# EAGLE design TouchSwitch-V2.0 (EAGLE 9.6.2)
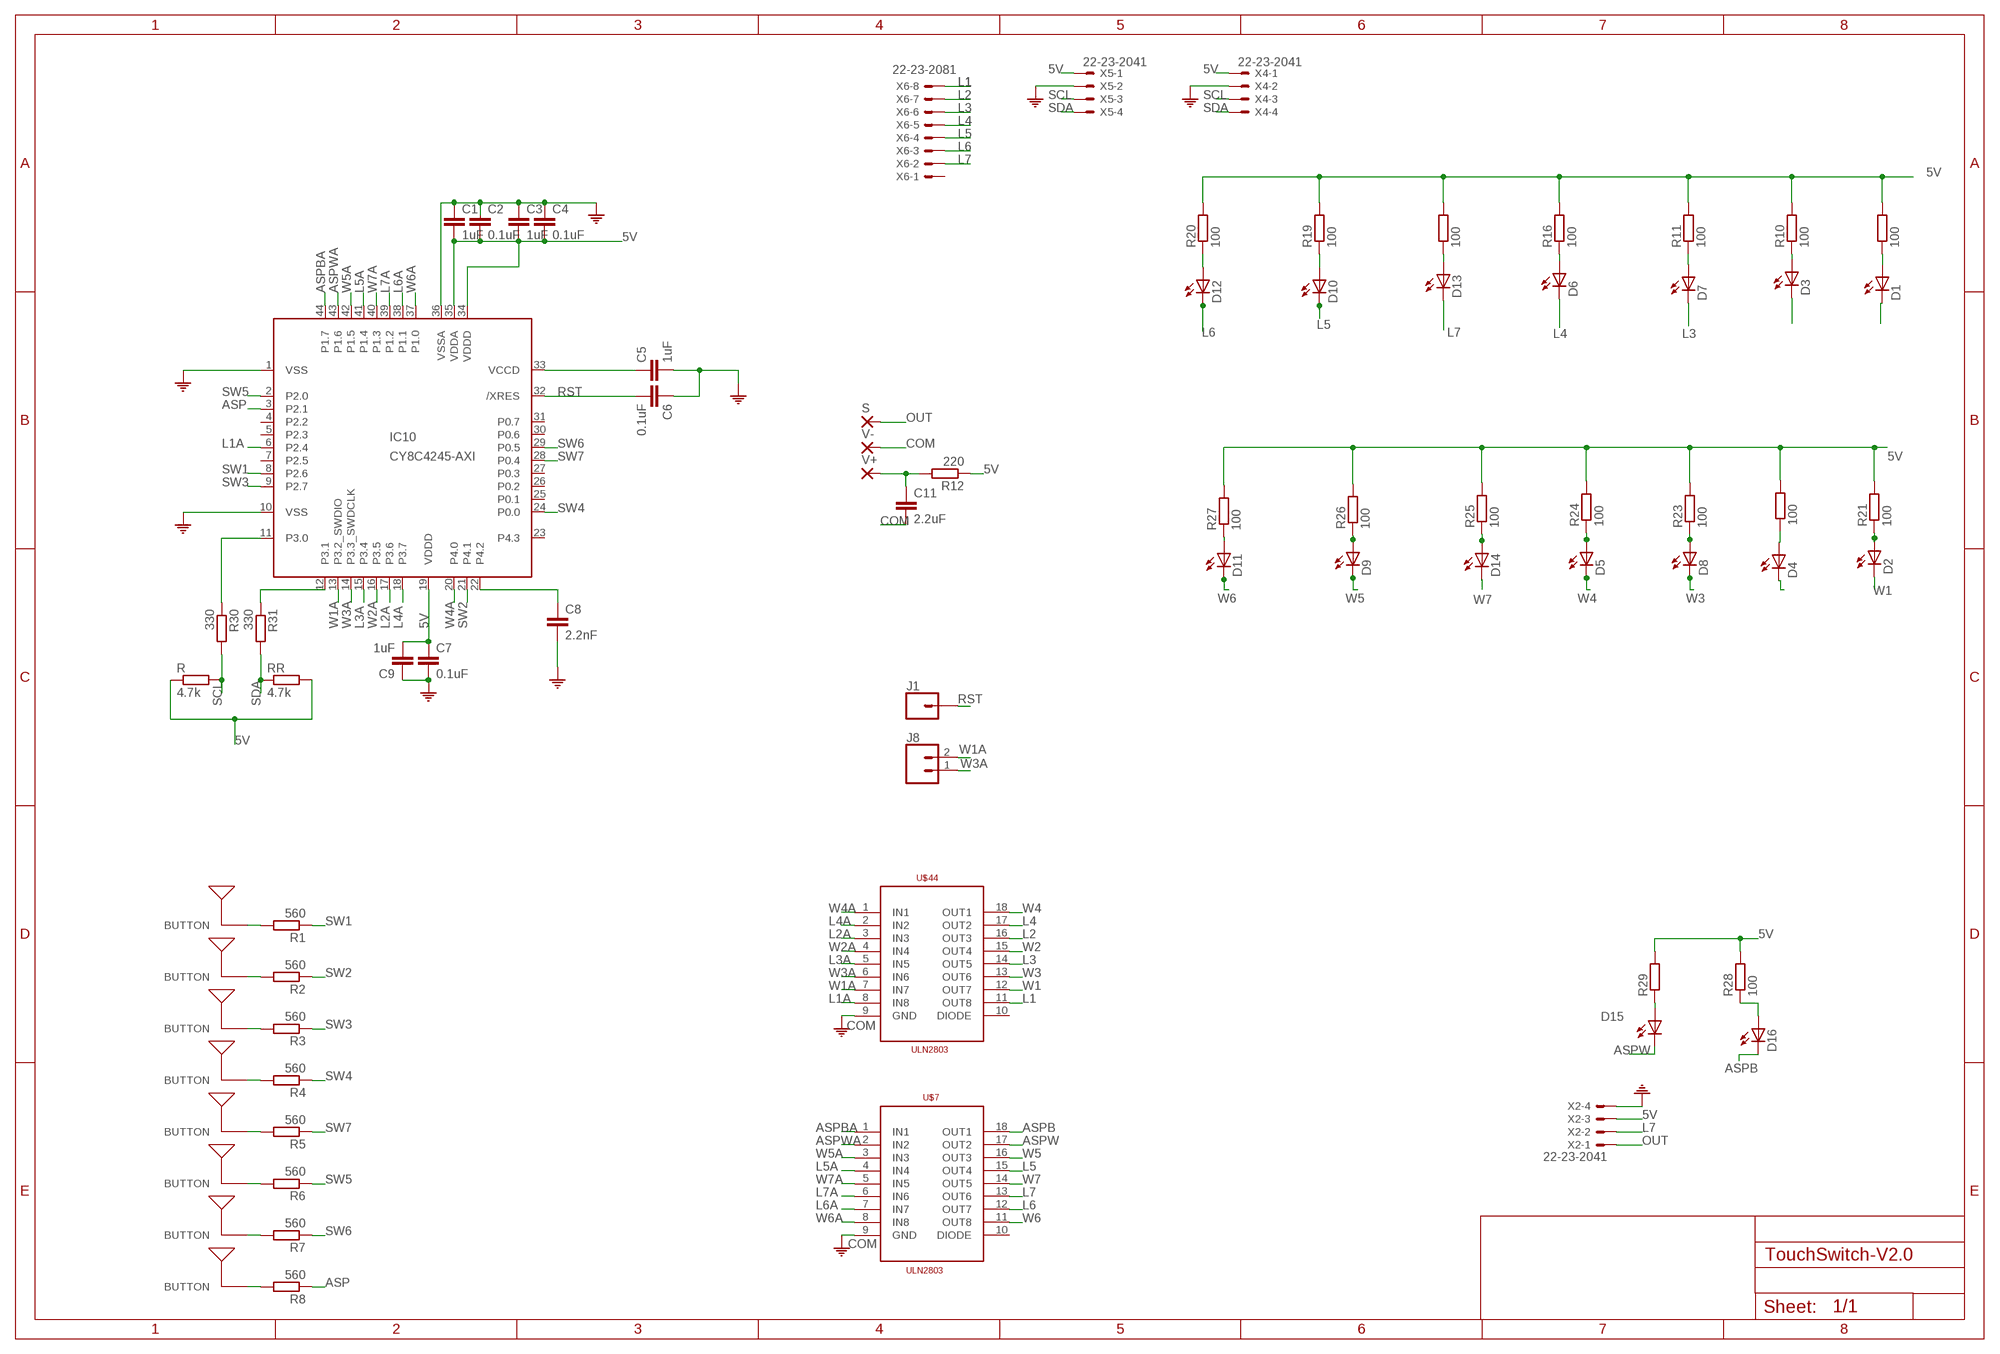
[diagram p0: schematic, sheet 1]

## Parts
B1  BUTTON_PASSIVE12MM  [BUTTON_PASSIVE_12MM]
B2  BUTTON_PASSIVE12MM  [BUTTON_PASSIVE_12MM]
B3  BUTTON_PASSIVE12MM  [BUTTON_PASSIVE_12MM]
B4  BUTTON_PASSIVE12MM  [BUTTON_PASSIVE_12MM]
B5  BUTTON_PASSIVE12MM  [BUTTON_PASSIVE_12MM]
B6  BUTTON_PASSIVE12MM  [BUTTON_PASSIVE_12MM]
B7  BUTTON_PASSIVE12MM  [BUTTON_PASSIVE_12MM]
B8  BUTTON_PASSIVE12MM  [BUTTON_PASSIVE_12MM]
C1  1uF  C-EUC1206  [C1206]
C2  0.1uF  C-EUC1206  [C1206]
C3  1uF  C-EUC1206  [C1206]
C4  0.1uF  C-EUC1206  [C1206]
C5  1uF  C-EUC1206  [C1206]
C6  0.1uF  C-EUC1206  [C1206]
C7  0.1uF  C-EUC1206  [C1206]
C8  2.2nF  C-EUC1206  [C1206]
C9  1uF  C-EUC1206  [C1206]
C11  2.2uF  C-EUC1206  [C1206]
D1  LEDCHIPLED_1206  [CHIPLED_1206]
D2  LEDCHIPLED_1206  [CHIPLED_1206]
D3  LEDCHIPLED_1206  [CHIPLED_1206]
D4  LEDCHIPLED_1206  [CHIPLED_1206]
D5  LEDCHIPLED_1206  [CHIPLED_1206]
D6  LEDCHIPLED_1206  [CHIPLED_1206]
D7  LEDCHIPLED_1206  [CHIPLED_1206]
D8  LEDCHIPLED_1206  [CHIPLED_1206]
D9  LEDCHIPLED_1206  [CHIPLED_1206]
D10  LEDCHIPLED_1206  [CHIPLED_1206]
D11  LEDCHIPLED_1206  [CHIPLED_1206]
D12  LEDCHIPLED_1206  [CHIPLED_1206]
D13  LEDCHIPLED_1206  [CHIPLED_1206]
D14  LEDCHIPLED_1206  [CHIPLED_1206]
D15  LEDCHIPLED_1206  [CHIPLED_1206]
D16  LEDCHIPLED_1206  [CHIPLED_1206]
IC10  CY8C4245-AXI  [44-TQFP-0.8]
J1  CONN_01  [1X01]
J8  CONN_02  [1X02]
R  4.7k  R-EU_R0805  [R0805]
R1  560  R-EU_R0805  [R0805]
R2  560  R-EU_R0805  [R0805]
R3  560  R-EU_R0805  [R0805]
R4  560  R-EU_R0805  [R0805]
R5  560  R-EU_R0805  [R0805]
R6  560  R-EU_R0805  [R0805]
R7  560  R-EU_R0805  [R0805]
R8  560  R-EU_R0805  [R0805]
R9  100  R-EU_R0805  [R0805]
R10  100  R-EU_R0805  [R0805]
R11  100  R-EU_R0805  [R0805]
R12  220  R-EU_R0805  [R0805]
R16  100  R-EU_R0805  [R0805]
R18  100  R-EU_R0805  [R0805]
R19  100  R-EU_R0805  [R0805]
R20  100  R-EU_R0805  [R0805]
R21  100  R-EU_R0805  [R0805]
R22  100  R-EU_R0805  [R0805]
R23  100  R-EU_R0805  [R0805]
R24  100  R-EU_R0805  [R0805]
R25  100  R-EU_R0805  [R0805]
R26  100  R-EU_R0805  [R0805]
R27  100  R-EU_R0805  [R0805]
R28  100  R-EU_R0805  [R0805]
R29  100  R-EU_R0805  [R0805]
R30  330  R-EU_R0805  [R0805]
R31  330  R-EU_R0805  [R0805]
RR  4.7k  R-EU_R0805  [R0805]
S  SMD2  [SMD1,27-2,54]
U$7  ULN2803  [SO18L]
U$44  ULN2803  [SO18L]
V+  SMD2  [SMD1,27-2,54]
V-  SMD2  [SMD1,27-2,54]
X2  22-23-2041  [22-23-2041]
X4  22-23-2041  [22-23-2041]
X5  22-23-2041  [22-23-2041]
X6  22-23-2081  [22-23-2081]

## Nets
5V: C1.2 C2.2 C3.2 C4.2 C7.1 C9.2 IC10.19(VDDD) IC10.34(VDDD) IC10.35(VDDA) R9.2 R10.2 R11.2 R12.1 R16.2 R18.2 R19.2 R20.2 R21.2 R22.2 R23.2 R24.2 R25.2 R26.2 R27.2 R28.2 R29.2 R.1 RR.2 X2.3 X4.1 X5.1
ASP: IC10.3(P2.1) R8.1
ASPB: D16.C U$7.18(OUT1)
ASPBA: IC10.44(P1.7) U$7.1(IN1)
ASPW: D15.C U$7.17(OUT2)
ASPWA: IC10.43(P1.6) U$7.2(IN2)
COM: C1.1 C2.1 C3.1 C4.1 C5.2 C6.1 C7.2 C8.2 C9.1 C11.2 IC10.1(VSS) IC10.10(VSS) IC10.36(VSSA) U$7.9(GND) U$44.9(GND) V-.1(P) X2.4 X4.2 X5.2
L1: D1.C U$44.11(OUT8) X6.8
L1A: IC10.6(P2.4) U$44.8(IN8)
L2: D3.C U$44.16(OUT3) X6.7
L2A: IC10.17(P3.6) U$44.3(IN3)
L3: D7.C U$44.14(OUT5) X6.6
L3A: IC10.15(P3.4) U$44.5(IN5)
L4: D6.C U$44.17(OUT2) X6.5
L4A: IC10.18(P3.7) U$44.2(IN2)
L5: D10.C U$7.15(OUT4) X6.4
L5A: IC10.41(P1.4) U$7.4(IN4)
L6: D12.C U$7.12(OUT7) X6.3
L6A: IC10.38(P1.1) U$7.7(IN7)
L7: D13.C U$7.13(OUT6) X2.2 X6.2
L7A: IC10.39(P1.2) U$7.6(IN6)
N$1: C8.1 IC10.22(P4.2)
N$2: B8.P$1(BUTTON) R1.2
N$3: IC10.11(P3.0) R30.1
N$4: B1.P$1(BUTTON) R2.2
N$5: IC10.12(P3.1) R31.1
N$6: D10.A R19.1
N$7: B2.P$1(BUTTON) R3.2
N$8: B3.P$1(BUTTON) R4.2
N$9: B4.P$1(BUTTON) R5.2
N$10: B5.P$1(BUTTON) R6.2
N$11: B6.P$1(BUTTON) R7.2
N$12: D13.A R18.1
N$13: C11.1 R12.2 V+.1(P)
N$14: D12.A R20.1
N$15: D6.A R16.1
N$16: B7.P$1(BUTTON) R8.2
N$17: D7.A R11.1
N$19: D15.A R29.1
N$23: D3.A R10.1
N$24: D1.A R9.1
N$25: D5.A R24.1
N$26: D11.A R27.1
N$27: D9.A R26.1
N$28: D14.A R25.1
N$29: D2.A R21.1
N$30: D4.A R22.1
N$31: D8.A R23.1
N$32: D16.A R28.1
N$47: C5.1 IC10.33(VCCD)
OUT: S.1(P) X2.1
RST: C6.2 IC10.32(/XRES) J1.1
SCL: R30.2 R.2 X4.3 X5.3
SDA: R31.2 RR.1 X4.4 X5.4
SW1: IC10.8(P2.6) R1.1
SW2: IC10.21(P4.1) R2.1
SW3: IC10.9(P2.7) R3.1
SW4: IC10.24(P0.0) R4.1
SW5: IC10.2(P2.0) R6.1
SW6: IC10.29(P0.5) R7.1
SW7: IC10.28(P0.4) R5.1
W1: D2.C U$44.12(OUT7)
W1A: IC10.13(P3.2_SWDIO) J8.2 U$44.7(IN7)
W2: D4.C U$44.15(OUT4)
W2A: IC10.16(P3.5) U$44.4(IN4)
W3: D8.C U$44.13(OUT6)
W3A: IC10.14(P3.3_SWDCLK) J8.1 U$44.6(IN6)
W4: D5.C U$44.18(OUT1)
W4A: IC10.20(P4.0) U$44.1(IN1)
W5: D9.C U$7.16(OUT3)
W5A: IC10.42(P1.5) U$7.3(IN3)
W6: D11.C U$7.11(OUT8)
W6A: IC10.37(P1.0) U$7.8(IN8)
W7: D14.C U$7.14(OUT5)
W7A: IC10.40(P1.3) U$7.5(IN5)
Unconnected: IC10.4(P2.2) IC10.5(P2.3) IC10.7(P2.5) IC10.23(P4.3) IC10.25(P0.1) IC10.26(P0.2) IC10.27(P0.3) IC10.30(P0.6) IC10.31(P0.7) U$7.10(DIODE) U$44.10(DIODE) X6.1

## Library data of the parts
B1-B8 = Touch mask demo - Copy:BUTTON_PASSIVE: Button, Passive Capacitive/Touch Sensing Type Source : http://www.PatternAgents.com Github : https://github.com/PatternAgents License : http://creativecommons.org/licenses/by-sa/3.1/ (Creative Commons 3.1) THIS SOFTWARE IS PROVIDED BY THE CONTRIBUTORS "AS IS" AND WITHOUT ANY EXPRESS OR IMPLIED WARRANTIES, INCLUDING, BUT NOT LIMITED TO, THE IMPLIED WARRANTIES OF MERCHANTABILITY AND FITNESS FOR A PARTICULAR PURPOSE ARE DISCLAIMED. IN NO EVENT SHALL THE COPYRIGHT OWNER OR CONTRIBUTORS BE LIABLE FOR ANY DIRECT, INDIRECT, INCIDENTAL, SPECIAL, EXEMPLARY, OR CONSEQUENTIAL DAMAGES (INCLUDING, BUT NOT LIMITED TO, PROCUREMENT OF SUBSTITUTE GOODS OR SERVICES; LOSS OF USE, DATA, OR PROFITS; OR BUSINESS INTERRUPTION) HOWEVER CAUSED AND ON ANY THEORY OF LIABILITY, WHETHER IN CONTRACT, STRICT LIABILITY, OR TORT (INCLUDING NEGLIGENCE OR OTHERWISE) ARISING IN ANY WAY OUT OF THE USE OF THIS SOFTWARE, EVEN IF ADVISED OF THE POSSIBILITY OF SUCH DAMAGE.
C1-C9 C11 = rcl:C-EU: CAPACITOR, European symbol; SPICEPREFIX: C
D1-D16 = led:LED: LED OSRAM: - CHIPLED LG R971, LG N971, LY N971, LG Q971, LY Q971, LO R971, LY R971 LH N974, LH R974 LS Q976, LO Q976, LY Q976 LO Q996 - Hyper CHIPLED LW Q18S LB Q993, LB Q99A, LB R99A - SideLED LS A670, LO A670, LY A670, LG A670, LP A670 LB A673, LV A673, LT A673, LW A673 LH A674 LY A675 LS A676, LA A676, LO A676, LY A676, LW A676 LS A679, LY A679, LG A679 - Hyper Micro SIDELED® LS Y876, LA Y876, LO Y876, LY Y876 LT Y87S - SmartLED LW L88C, LW L88S LB L89C, LB L89S, LG L890 LS L89K, LO L89K, LY L89K LS L896, LA L896, LO L896, LY L896 - TOPLED LS T670, LO T670, LY T670, LG T670, LP T670 LSG T670, LSP T670, LSY T670, LOP T670, LYG T670 LG T671, LOG T671, LSG T671 LB T673, LV T673, LT T673, LW T673 LH T674 LS T676, LA T676, LO T676, LY T676, LB T676, LH T676, LSB T676, LW T676 LB T67C, LV T67C, LT T67C, LS T67K, LO T67K, LY T67K, LW E67C LS E67B, LA E67B, LO E67B, LY E67B, LB E67C, LV E67C, LT E67C LW T67C LS T679, LY T679, LG T679 LS T770, LO T770, LY T770, LG T770, LP T770 LB T773, LV T773, LT T773, LW T773 LH T774 LS E675, LA E675, LY E675, LS T675 LS T776, LA T776, LO T776, LY T776, LB T776 LHGB T686 LT T68C, LB T68C - Hyper Mini TOPLED® LB M676 - Mini TOPLED Santana® LG M470 LS M47K, LO M47K, LY M47K Source: http://www.osram.convergy.de LUXEON: - LUMILED® LXK2-PW12-R00, LXK2-PW12-S00, LXK2-PW14-U00, LXK2-PW14-V00 LXK2-PM12-R00, LXK2-PM12-S00, LXK2-PM14-U00 LXK2-PE12-Q00, LXK2-PE12-R00, LXK2-PE12-S00, LXK2-PE14-T00, LXK2-PE14-U00 LXK2-PB12-K00, LXK2-PB12-L00, LXK2-PB12-M00, LXK2-PB14-N00, LXK2-PB14-P00, LXK2-PB14-Q00 LXK2-PR12-L00, LXK2-PR12-M00, LXK2-PR14-Q00, LXK2-PR14-R00 LXK2-PD12-Q00, LXK2-PD12-R00, LXK2-PD12-S00 LXK2-PH12-R00, LXK2-PH12-S00 LXK2-PL12-P00, LXK2-PL12-Q00, LXK2-PL12-R00 Source: www.luxeon.com KINGBRIGHT: KA-3528ASYC Source: www.kingbright.com
IC10 = CY8C4200:CY8C4245: PSOC4200 in TQFP-44 Source:
J1 = SparkFun-Connectors:CONN_01: Single connection point. Often used as Generic Header-pin footprint for 0.1 inch spaced/style header connections On any of the 0.1 inch spaced packages, you can populate with these: Break Away Headers - Straight <https://www.sparkfun.com/products/116> (PRT-00116) Break Away Male Headers - Right Angle <https://www.sparkfun.com/products/553> (PRT-00553) Female Headers <https://www.sparkfun.com/products/115> (PRT-00115) Break Away Headers - Machine Pin <https://www.sparkfun.com/products/117> (PRT-00117) Break Away Female Headers - Swiss Machine Pin <https://www.sparkfun.com/products/743> (PRT-00743) This device is also useful as a general connection point to wire up your design to another part of your project. Our various solder wires solder well into these plated through hole pads. Hook-Up Wire - Assortment (Stranded, 22 AWG) <https://www.sparkfun.com/products/11375> (PRT-11375) Hook-Up Wire - Assortment (Solid Core, 22 AWG) <https://www.sparkfun.com/products/11367> (PRT-11367) View the entire wire category on our website here <https://www.sparkfun.com/categories/141> Special notes: SMTSO-256-ET is a "flush mount" nut for a 4-40 screw. We mostly use this on specialty testbeds; it is a nice way to connect hardware to your PCB at an adjustable hieght. Also note, the SNAP packages are for using a snappable style connector. We sell a baggie of snaps and they are also used on two LilyPad designs: Snap Assortment - 30 pack (male and female) <https://www.sparkfun.com/products/11347> (DEV-11347) LilyPad Arduino SimpleSnap <https://www.sparkfun.com/products/10941> (DEV-10941) LilyPad SimpleSnap Protoboard <https://www.sparkfun.com/products/10940> (DEV-10940)
J8 = SparkFun-Connectors:CONN_02: Multi connection point. Often used as Generic Header-pin footprint for 0.1 inch spaced/style header connections On any of the 0.1 inch spaced packages, you can populate with these: Break Away Headers - Straight <https://www.sparkfun.com/products/116> (PRT-00116) Break Away Male Headers - Right Angle <https://www.sparkfun.com/products/553> (PRT-00553) Female Headers <https://www.sparkfun.com/products/115> (PRT-00115) Break Away Headers - Machine Pin <https://www.sparkfun.com/products/117> (PRT-00117) Break Away Female Headers - Swiss Machine Pin <https://www.sparkfun.com/products/743> (PRT-00743) For SCREWTERMINALS and SPRING TERMINALS visit here: Screw Terimnals on SparkFun.com <https://www.sparkfun.com/search/results?term=Screw+Terminals> (5mm/3.5mm/2.54mm spacing) This device is also useful as a general connection point to wire up your design to another part of your project. Our various solder wires solder well into these plated through hole pads. Hook-Up Wire - Assortment (Stranded, 22 AWG) <https://www.sparkfun.com/products/11375> (PRT-11375) Hook-Up Wire - Assortment (Solid Core, 22 AWG) <https://www.sparkfun.com/products/11367> (PRT-11367) View the entire wire category on our website here <https://www.sparkfun.com/categories/141> Special notes: Molex polarized connector foot print use with: PRT-08233 with associated crimp pins and housings. 2.54_SCREWTERM for use with PRT-10571. 3.5mm Screw Terminal footprints for PRT-08084 5mm Screw Terminal footprints for use with PRT-08432
R R1-R12 R16 R18-R31 RR = resistor:R-EU_: RESISTOR, European symbol
S V+ V- = wirepad:SMD2: SMD PAD
U$7 U$44 = uln2803:ULN2803
X2 X4 X5 = con-molex-new white color :22-23-2041: .100" (2.54mm) Center Header - 4 Pin
X6 = con-molex-new white color :22-23-2081: .100" (2.54mm) Center Header - 8 Pin

## Board
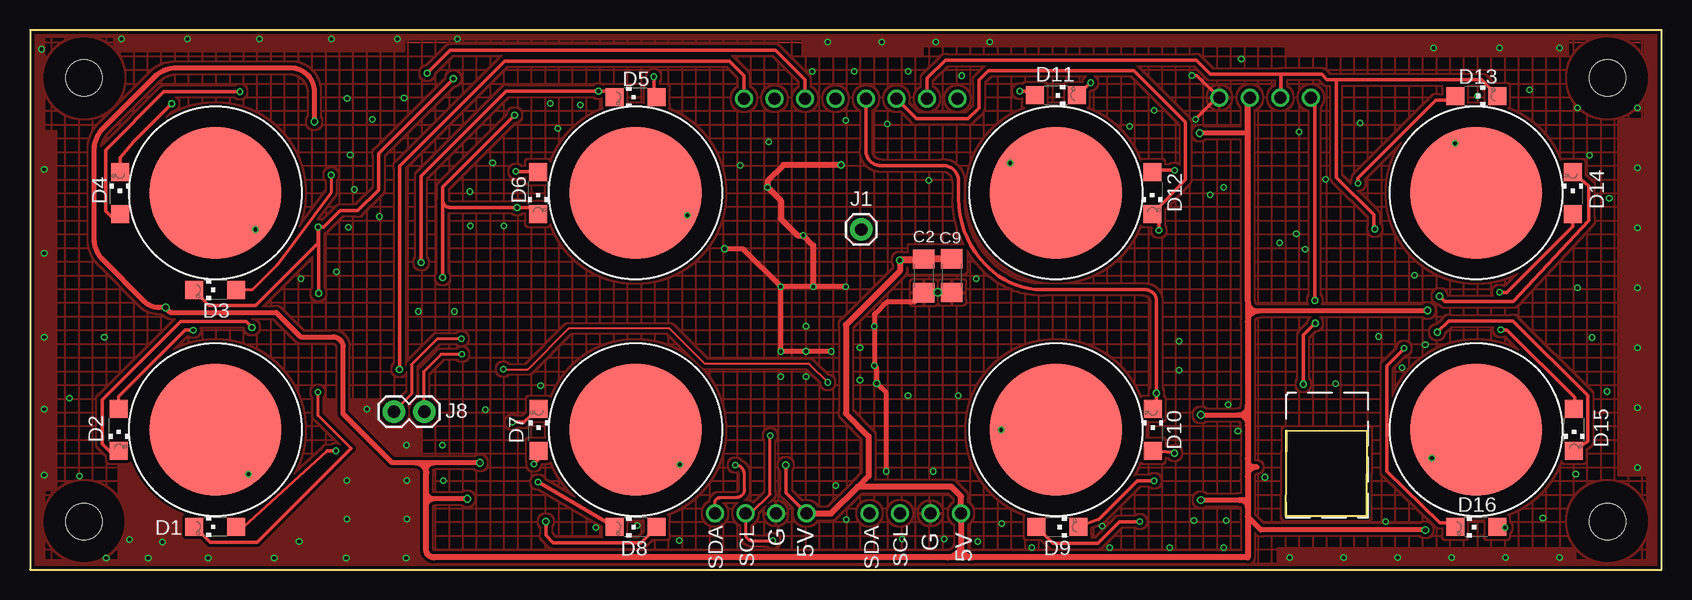
[diagram p1: board, top side]
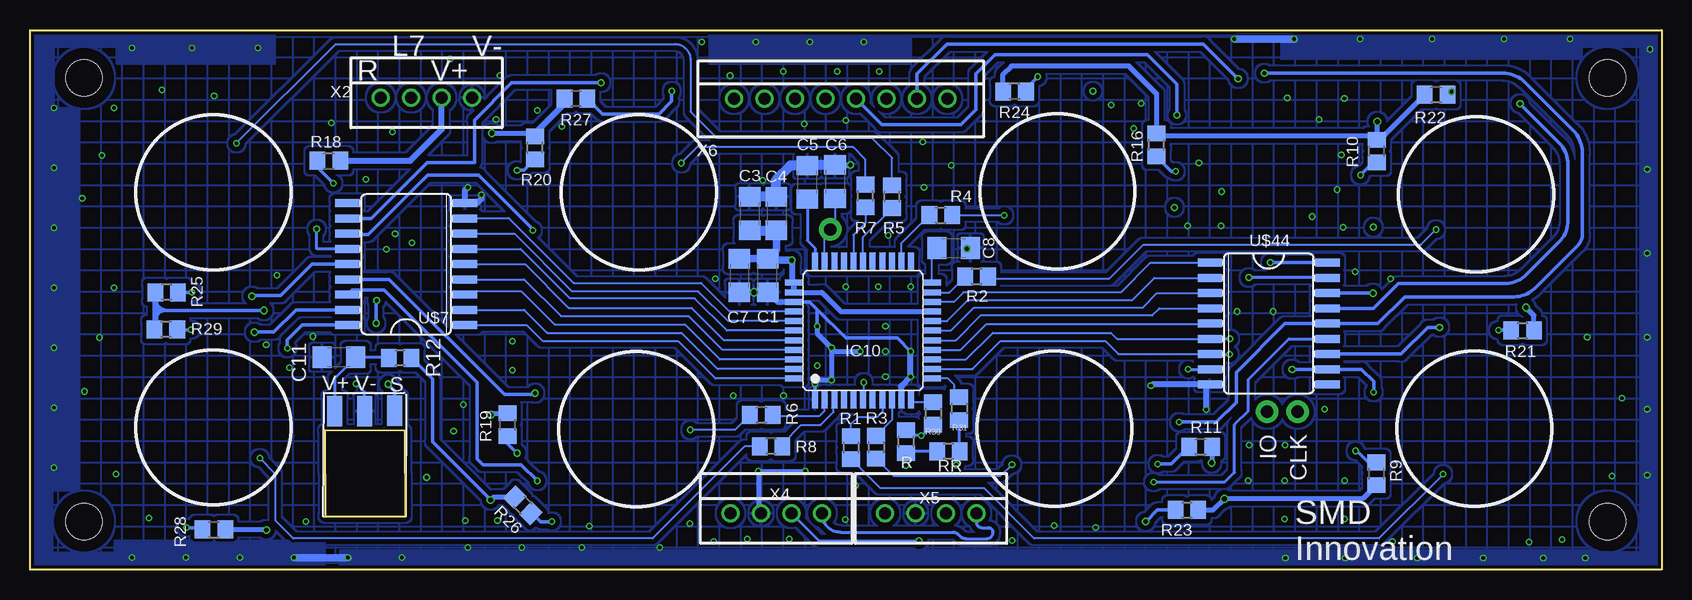
[diagram p2: board, bottom side, seen from below]

Size 136 x 45 mm. Coordinates in mm from the lower left corner, seen from the top.
Outline: 136,45 0,45 0,0 136,0 136,45
Outline: 111.4,4.45 104.7,4.45 104.75,11.55 111.45,11.6 111.4,4.45
Copper layers (1*16): Top 0.018mm / dielectric 1.55mm / Bottom 0.018mm
Design rules "eC_2Layer_PClass6_BaseCopperO18_eCDefault *": minimum track width 0.15mm, minimum drill 0.1mm, track to track 0.15mm, track to pad 0.15mm, pad to pad 0.15mm, via to via 0.15mm, smd to smd 0mil, copper to edge 0.25mm, drill to drill 0.35mm, minimum pad ring 0.175mm, minimum via ring 0.125mm, stop-mask expansion 0mil, vias tented up to drill 0.35mm, thermal gap 0.2mm
Holes 3 mm at 131.5,4 131.5,41 4.5,41 4.5,4
tRestrict: area 113.4,4.5 to 127.7,18.9; area 113.4,24.2 to 127.7,38.6; area 78.3,4.5 to 92.7,18.9; area 78.3,24.2 to 92.7,38.6; area 43.3,4.5 to 57.7,18.9; area 43.3,24.2 to 57.7,38.6; area 8.2,24.2 to 22.7,38.6; area 8.2,4.5 to 22.7,18.9; area 128.5,1 to 134.5,7; area 128.5,38 to 134.5,44; area 1.5,38 to 7.5,44; area 1.5,1 to 7.5,7
bRestrict: area 129.5,2 to 133.5,6; area 129.5,39 to 133.5,43; area 2.5,39 to 6.5,43; area 2.5,2 to 6.5,6

### Footprints (pad centres in the part's own frame; a part is rotated, then mirrored left to right if it is on the bottom)
BUTTON_PASSIVE_12MM = smd 11 x 11: P$1 0,0
C1206 = smd 1.6 x 1.8: 1 -1.4,0; 2 1.4,0
CHIPLED_1206 = smd 1.5 x 1.5: A 0,-1.75; C 0,1.75
44-TQFP-0.8 = smd 1.5 x 0.5: 1 -5.75,4; 2 -5.75,3.2; 3 -5.75,2.4; 4 -5.75,1.6; 5 -5.75,0.8; 6 -5.75,0; 7 -5.75,-0.8; 8 -5.75,-1.6; 9 -5.75,-2.4; 10 -5.75,-3.2; 11 -5.75,-4; 23 5.75,-4; 24 5.75,-3.2; 25 5.75,-2.4; 26 5.75,-1.6; 27 5.75,-0.8; 28 5.75,0; 29 5.75,0.8; 30 5.75,1.6; 31 5.75,2.4; 32 5.75,3.2; 33 5.75,4 | smd 0.5 x 1.5: 12 -4,-5.75; 13 -3.2,-5.75; 14 -2.4,-5.75; 15 -1.6,-5.75; 16 -0.8,-5.75; 17 0,-5.75; 18 0.8,-5.75; 19 1.6,-5.75; 20 2.4,-5.75; 21 3.2,-5.75; 22 4,-5.75; 34 4,5.75; 35 3.2,5.75; 36 2.4,5.75; 37 1.6,5.75; 38 0.8,5.75; 39 0,5.75; 40 -0.8,5.75; 41 -1.6,5.75; 42 -2.4,5.75; 43 -3.2,5.75; 44 -4,5.75
1X01 = drill 1.016 pad 1.88: 1 0,0
1X02 = drill 1.016 pad 1.88: 1 0,0; 2 2.54,0
R0805 = smd 1.3 x 1.5: 1 -0.95,0; 2 0.95,0
SMD1,27-2,54 = smd 1.27 x 2.54: 1 0,0
SO18L = smd 0.66 x 2.032: 1 -5.08,-4.902; 2 -3.81,-4.902; 3 -2.54,-4.902; 4 -1.27,-4.902; 5 0,-4.902; 6 1.27,-4.902; 7 2.54,-4.902; 8 3.81,-4.902; 9 5.08,-4.902; 10 5.08,4.902; 11 3.81,4.902; 12 2.54,4.902; 13 1.27,4.902; 14 0,4.902; 15 -1.27,4.902; 16 -2.54,4.902; 17 -3.81,4.902; 18 -5.08,4.902
22-23-2041 = drill 1: 1 -3.81,0; 2 -1.27,0; 3 1.27,0; 4 3.81,0
22-23-2081 = drill 1: 1 -8.89,0; 2 -6.35,0; 3 -3.81,0; 4 -1.27,0; 5 1.27,0; 6 3.81,0; 7 6.35,0; 8 8.89,0

### Placement (x,y rotation side)
B1  15.45,31.41 180 top
B2  50.48,11.66 180 top
B3  50.48,31.41 180 top
B4  120.55,31.41 180 top
B5  85.52,11.66 180 top
B6  85.52,31.41 180 top
B7  120.55,11.66 180 top
B8  15.45,11.66 180 top
C1  74.51,24.52 90 bottom
C2  74.51,24.48 90 top
C3  76.02,29.69 270 bottom
C4  73.78,29.69 270 bottom
C5  71.2,32.3 90 bottom
C6  68.89,32.35 270 bottom
C7  76.87,24.52 270 bottom
C8  59,26.81 0 bottom
C9  76.84,24.52 90 top
C11  110.25,17.7 180 bottom
D1  15.45,3.57 90 top
D2  7.4,11.66 180 top
D3  15.45,23.33 90 top
D4  7.5,31.41 0 top
D5  50.48,39.4 90 top
D6  42.35,31.41 180 top
D7  42.4,11.66 0 top
D8  50.48,3.55 90 top
D9  85.65,3.55 270 top
D10  93.6,11.66 0 top
D11  85.52,39.55 270 top
D12  93.55,31.41 180 top
D13  120.55,39.5 270 top
D14  128.6,31.41 0 top
D15  128.7,11.66 180 top
D16  120.55,3.55 90 top
IC10  66.56,19.92 90 bottom
J1  69.3,28.37 180 top
J8  30.33,13.16 0 top
R  62.97,10.66 90 bottom
R1  67.57,10.18 270 bottom
R2  57.09,24.45 0 bottom
R3  65.47,10.2 270 bottom
R4  60.08,29.55 0 bottom
R5  64.14,31.1 90 bottom
R6  75.04,12.88 180 bottom
R7  66.36,31.16 90 bottom
R8  74.23,10.28 180 bottom
R9  23.78,7.99 270 bottom
R10  23.75,34.9 90 bottom
R11  38.42,10.25 0 bottom
R12  105.15,17.65 180 bottom
R16  42.1,35.41 90 bottom
R18  111.08,34.09 0 bottom
R19  96.2,12.09 90 bottom
R20  93.89,35.17 90 bottom
R21  11.59,19.94 0 bottom
R22  18.8,39.59 180 bottom
R23  39.56,4.97 0 bottom
R24  53.93,39.88 180 bottom
R25  124.61,23.12 180 bottom
R26  94.92,5.36 135 bottom
R27  90.48,39.28 180 bottom
R28  120.67,3.34 0 bottom
R29  124.68,20.02 180 bottom
R30  60.72,13.03 270 bottom
R31  58.55,13.41 270 bottom
RR  59.44,9.86 180 bottom
S  105.6,13.25 180 bottom
U$7  104.64,25.46 90 bottom
U$44  32.75,20.52 270 bottom
V+  110.6,13.2 180 bottom
V-  108.1,13.2 180 bottom
X2  102.95,39.35 0 bottom
X4  73.8,4.68 0 bottom
X5  60.9,4.68 0 bottom
X6  68.41,39.25 0 bottom

### Tracks (layer width: path | path; a pad name or v marks a point on that pad's centre or on a via)
5V  (via drill 0.35, 0.4)
  Top 0.305: v63,8.7 63,6.39 X5.1
  Top 0.406: v97.5,36.4 97.55,36.45 101.4,36.45 101.5,36.55 | v116.3,3.3 102.6,3.3 101.5,4.4 | 101.5,7.75 arc-90 102.3,8.55 102.1,8.55 arc-90 101.5,9.15 101.5,9.25 | v97.6,5.8 100.85,5.8 arc-90 101.5,5.15 | v97.6,12.9 100.75,12.9 | 100.75,12.9 arc-90 101.5,12.05 | 100.75,12.9 arc90 101.5,13.65 | v36.45,5.9 33.7,5.9 | 33.7,5.9 arc90 33,5.2 | 33.7,5.9 arc-90 33,6.6 33,7 | v37.5,8.9 33.7,8.9 | 33.7,8.9 32.1,8.9 | 32.1,8.9 30.2,8.9 26.1,13 26.1,18.55 arc90 25.25,19.4 22.55,19.4 20.5,21.45 11.7,21.45 v11.3,21.85 10.72,21.85 arc-45 9.58,22.32 6.09,25.81 arc-45 5.35,27.6 5.35,35 arc-45 6.09,36.79 10.41,41.11 arc-45 12.2,41.85 21.7,41.85 arc-90 23.7,39.85 v23.7,37.35 | 33,8.2 arc-90 33.7,8.9 | 32.1,8.9 arc-90 33,8 | v116.5,21.6 116.45,21.55 102.4,21.55 | 102.4,21.55 102.35,21.55 arc-90 101.5,22.4 | 101.5,20.65 arc-90 102.4,21.55
  Top 0.508: v72.5,25.8 72.5,24.9 68,20.4 68,13.03 69.9,11.12 69.9,7.8 69,6.9 | 78.5,1.02 101.5,1.02 101.5,4.4 101.5,5.15 101.5,5.7 | 78.5,1.02 76.5,1.02 | 101.5,5.7 101.5,7.75 101.5,9.25 101.5,12.05 101.5,13.65 101.5,20.65 101.5,22.4 101.5,36.55 101.5,39.17 X2.3 | 76.5,1.02 33.68,1.02 arc-90 33,1.7 33,5.2 33,7 33,8 33,8.2 | 77.61,2.13 X4.1 77.61,6.09 76.8,6.9 69,6.9 | 77.61,2.13 arc-90 76.5,1.02 | X5.1 66.78,4.68 69,6.9 | 77.61,2.13 77.61,1.91 arc90 78.5,1.02 | 100.85,5.8 101.4,5.8 101.5,5.7
  Top 0.6: C9.2 76.81,25.88 C2.2 74.42,25.8 v72.5,25.8
  Bottom 0.254: R.1 62.81,9.86 RR.2
  Bottom 0.305: 63,9.68 v63,8.7 | 125.55,21.6 124.7,21.6 | 124.5,21.6 v116.5,21.6 | 124.5,21.6 124.7,21.6 | 124.7,21.6 arc-90 125.55,20.75 | R25.2 125.55,22.66 arc-90 124.5,21.6 | v97.6,5.8 102.45,10.65 102.45,15.9 R12.1
  Bottom 0.406: 125.55,20.09 R29.2 | R28.2 116.33,3.34 v116.3,3.3 | v97.5,36.4 v97.49,36.39 93.89,36.39 | R26.2 97.37,6.03 v97.6,5.8 | v97.6,12.9 97.46,13.04 R19.2 | R24.2 54.88,41.32 54.2,42 44.39,42 42.1,39.7 R16.2 41.9,36.16 24.06,36.16 R10.2 | R9.2 24.92,5.9 v36.45,5.9 37.38,4.97 R23.2 | IC10.19 68.39,21.52 69.99,23.12 IC10.35 | R11.2 37.5,10.21 v37.5,8.9 | v23.7,37.35 arc-90 23.75,37.3 R10.2 | R22.2 23.48,35.85 R10.2 | R21.2 10.64,21.19 v11.3,21.85
  Bottom 0.508: R27.2 91.44,38.84 93.89,36.39 R20.2 | IC10.35 IC10.34 72.5,24.12 v72.5,25.8 | R.1 63,9.68 | R18.2 104.31,34.09 101.68,36.72 X2.3 | R25.2 125.55,21.6 125.55,20.75 125.55,20.09
  Bottom 0.61: C7.1 C1.2 | C4.2 73.78,26.64 C1.2 | v72.5,25.8 74.39,25.8 C1.2
  Bottom 0.813: C3.2 C4.2
ASP
  Bottom 0.18: R8.1 73.28,10.48 71.72,12.05 70.1,12.05 69.01,13.14 69.01,14.12 IC10.3
ASPB  (via drill 0.3)
  Top 0.305: v114.55,18.45 113.1,17 113.1,8.17 117.54,3.9 118.45,3.9 D16.C
  Bottom 0.305: U$7.18 113.32,20.38 114.55,19.15 v114.55,18.45
ASPBA
  Bottom 0.18: IC10.44 78.87,15.92 82,19.05 93.26,19.05 94.59,20.38 U$7.1
ASPW  (via drill 0.35)
  Top 0.305: D15.C 129.85,10.7 129.85,14.54 123.61,20.75 118.25,20.75 v117.3,19.8
  Bottom 0.305: U$7.17 113.82,21.66 115.68,19.8 v117.3,19.8
ASPWA
  Bottom 0.18: IC10.43 78.67,16.72 81.7,19.75 92.89,19.75 94.79,21.66 U$7.2
COM  (via drill 0.3, 0.35, 0.45)
  Top 0.305: v96.85,41.2 97.29,41.2 X2.4 98.95,39.35 v97.15,37.55
  Top 0.406: v71.39,8.19 71.39,14.72 v70.58,15.53 70.58,16.8 v70.39,16.99 v70.39,20.29 70.39,21.29 71.4,22.3 73.72,22.3 C2.1 | v62.59,23.59 v62.59,18.19 v64.69,18.19 v66.78,18.19 | v67.98,23.59 v65.28,23.59 v62.59,23.59 | v62.59,23.59 59.42,26.75 v57.9,26.75
  Top 0.508: v67.6,33.75 62.8,33.75 61.48,32.43 v61.48,31.88 62.6,30.76 62.6,29.25 63.99,27.86 v64.47,27.86 65.28,27.04 v65.28,23.59
  Top 0.6: C9.1 76.81,23.09 C2.1
  Bottom 0.254: V-.1 108.1,14.78 v108.83,15.5
  Bottom 0.305: v70.58,15.53 70.58,14.19 IC10.1 | IC10.36 71.02,22.32 70.39,21.68 | 70.39,21.68 68,19.3 63.7,19.3 v62.59,18.19 | v70.39,20.29 70.39,21.68
  Bottom 0.406: X4.2 75.28,4.89 v75.28,8.19 v71.39,8.19 | v70.39,20.29 70.39,19.69 v69.19,18.49 | v69.19,18.49 v69.19,15.79 70.31,15.79 v70.58,15.53 | v69.19,18.49 68.89,18.19 v66.78,18.19
  Bottom 0.45: IC10.36 73.7,22.32 C1.1 v75.65,23.12 C7.2
  Bottom 0.508: v99.48,31.89 99.74,31.63 U$7.9 98.73,30.55 98.39,30.89 v98.39,31.24 | v42.56,15.32 42.45,15.44 U$44.9 37.96,15.12 v37.96,13.32 | IC10.10 63.36,15.32 v62.59,16.09 v62.59,18.19 | C6.1 v67.6,33.75
  Bottom 0.61: v114,1 v109.5,1 | v30.62,44.25 v35.62,44.25
  Bottom 0.813: C3.1 C4.1 73.81,31.12 73.81,32.5 72.62,33.7 C5.2 71.14,33.75 C6.1
  other vias: 0.95,43.4 134,8.5 134,13.5 134,18.5 134,23.5 134,28.5 134,33.5 134,38.5 130,34.55 129,38.5 131.65,30.95 129,23.5 130.2,19.35 131.45,14.85 128.85,7.95 127.5,43.5 122.5,43.5 117,43.5 125,40 120.65,39.5 127.5,1 123,1 118.5,1 105,1 126.1,4.3 113,4 99.72,4.1 97.02,4.1 99.48,1.82 94.98,1.82 89.98,1.82 83.48,1.82 78.98,2.32 80.98,3.82 76.2,2.54 72.7,2.54 80,44 75.5,44 71,44 66.5,44 73.2,41.54 68.7,41.54 65.2,41.54 71.45,37.16 68,37.47 61.59,35.66 25.12,44.25 19.12,44.25 13.12,44.25 7.62,44.25 31.36,0.97 26.36,0.97 20.36,0.97 14.86,0.97 9.86,0.97 6.36,0.97 22.44,2.34 11.04,2.29 8.29,2.49 1.19,7.89 4.14,7.79 3.29,14.29 1.19,13.39 6.19,19.39 1.19,19.39 1.19,26.39 1.19,33.39 31.42,4.21 26.42,4.21 31.41,7.41 26.41,7.41 34.46,7.42 35.36,21.52 32.36,21.52 39.51,28.67 36.71,28.67 36.66,31.52 38.56,33.92 29.14,29.44 34.39,10.39 31.39,10.39 28.09,13.39 27.03,31.69 45.89,38.74 43.39,38.89 43.98,36.79 64.69,20.29 64.69,16.09 100.69,11.54 99.88,13.76 104.18,27.26 106.3,26.72 105.56,27.98 108,32.55 93.7,38.3 91.68,36.95 115.41,24.54 112.41,19.43 116.31,18.73 114.36,16.84 95.79,16.64 95.79,19.04 102.94,7.69 77.65,41.19 77.39,14.49 73.19,14.49 89.39,3.62 50.62,3.66 47.17,3.51 54.12,2.41 67.16,7 68.03,4.16 110.89,37.24 105.8,36.49 100.98,42.59 26.54,28.54 25.54,24.84 22.59,24.24 26.69,34.59 31.19,39.34 26.44,39.29 28.53,37.54 74.92,32.46 78.87,24.26 59.22,33.71
  pour Bottom (isolate 0.381, hatched): 136,0 0,0 0,45 135.45,45.02 136,44.98
  pour Top (isolate 0.254, hatched): 136,0 0,0 0,45 136,45
  pour Top (isolate 0.25): 128.2,42.8 104.8,42.8 104.8,43.6 74.4,43.6 74.4,42.8 64.4,42.8 64.4,44.2 31.2,44.2 31.2,43.2 7,43.2 7,44.4 1.2,44.4 1.2,36.6 2.2,36.6 2.2,6.6 1.2,6.6 1.2,0.8 7.4,0.8 7.4,14.25 32.5,14.25 32.5,0.1 -0.05,0.1 -0.05,45 136,45 136,-1 104,-1 104,1.8 128.8,1.8 128.8,0.8 134.8,0.8 134.8,7.8 132.4,7.8 132.4,37.6 134.6,37.6 134.6,44.2 128.2,44.2
  pour Bottom (isolate 0.25): 115.55,42.2 115.55,44.9 135.95,44.9 135.95,-0.8 111.4,-0.8 111.4,2.4 129,2.4 129,1.4 134.1,1.4 134.1,6.6 132,6.6 132,38.5 134,38.5 134,43.6 128.8,43.6 128.8,42.2
  pour Bottom (isolate 0.25): 79.4,45 79.4,42.2 62.6,42.2 62.6,44.6 31.75,44.6 31.75,42.6 6.6,42.6 6.6,43.6 0,43.6 0,45
  pour Bottom (isolate 0.25): 1.8,45 1.8,1.45 5.25,1.45 5.4,1.6 110.2,1.6 110.2,0.1 0,0.1 0,45
  cutout Top: 77.85,24.75 78.05,24.95 78.05,27 73.25,27 73.25,24.75
L1  (via drill 0.3, 0.35)
  Top 0.254: 26.76,10.09 24,12.85 v24,14.8
  Top 0.305: D1.C 15.04,2.27 18.94,2.27 26.76,10.09 | v30.8,16.7 30.8,33.65 39.55,42.4 58.3,42.4 59.52,41.18 X6.8
  Bottom 0.305: v24,14.8 24,15.7 25.01,16.7 U$44.11 v30.8,16.7
L1A  (via drill 0.3)
  Top 0.18: v66.5,15.6 64.95,17.15 56.25,17.15 53.3,20.1 44.9,20.1 41.5,16.7 v39.45,16.7
  Bottom 0.18: IC10.6 66.5,14.22 v66.5,15.6
  Bottom 0.254: v39.45,16.7 U$44.8
L2  (via drill 0.35)
  Top 0.305: v35.3,40.95 29.05,34.7 29.05,31.65 27.32,29.92 25.85,29.92 24.48,28.55 v24.02,28.55 | v24.02,28.55 24.02,27.25 18.8,22.03 14.92,22.03 D3.C | v24.05,23.05 24.05,28.52 v24.02,28.55
  Bottom 0.305: v35.3,40.95 38.17,43.82 59.58,43.82 62.06,41.34 X6.7 | U$44.16 v24.05,23.05
L2A
  Bottom 0.18: U$44.3 42.05,23.05 43.25,21.85 57.3,21.85 59.23,19.92 IC10.17
L3  (via drill 0.3, 0.35)
  Top 0.305: D7.C 41.19,12.3 v40.2,12.3 | X6.6 64.6,40.86 62.16,43.3 35,43.3 v33.1,41.4
  Bottom 0.305: v40.2,12.3 37.1,12.3 35.45,13.95 35.45,16.45 31.39,20.52 U$44.14 23.64,20.52 21.4,22.75 12.3,22.75 arc-45 10.51,23.49 6.95,27.05 arc-45 6.6,27.89 6.6,34.8 arc-45 7.34,36.59 11.41,40.66 arc-45 13.2,41.4 v33.1,41.4
L3A
  Bottom 0.18: U$44.5 37.71,20.45 56.3,20.45 58.43,18.32 IC10.15
L4  (via drill 0.35)
  Top 0.305: v40.4,37.9 34.4,31.9 34.4,30.8 | D6.C 41.72,30.2 v40.6,30.2 35,30.2 arc-90 34.4,30.8 | v34.4,24.35 34.4,30.8
  Bottom 0.254: U$44.17 27.87,24.35 v34.4,24.35
  Bottom 0.305: v40.4,37.9 40.4,40.5 42.84,42.94 55.56,42.94 57.15,41.35 57.15,38.35 58.4,37.1 64.98,37.1 X6.5
L4A
  Bottom 0.18: IC10.18 59.55,20.72 57.8,22.48 44.12,22.48 42.28,24.32 U$44.2
L5  (via drill 0.35)
  Top 0.305: X6.4 69.68,34.92 arc90 70.9,33.7 76.1,33.7 arc-90 77.4,32.4 77.4,30.94 arc45 79.69,25.41 79.9,25.2 arc45 84.38,23.34 92.95,23.34 arc-90 93.9,22.4 v93.9,14.7 93.9,13.56 D10.C
  Bottom 0.254: 93.95,14.65 v93.9,14.7
  Bottom 0.305: U$7.15 106.05,24.2 96.45,14.6 94,14.6 93.95,14.65
L5A
  Bottom 0.18: IC10.41 78.29,18.32 81.1,21.13 91.73,21.13 94.79,24.2 U$7.4
L6  (via drill 0.3)
  Top 0.305: X6.3 73.88,37.6 78.2,37.6 79.1,38.5 79.1,40.8 79.9,41.6 92,41.6 96.3,37.3 96.3,32.52 D12.C 94.1,29.21 v94.1,28.3
  Bottom 0.305: U$7.12 108.35,28.01 108.3,27.95 107.8,27.95 102.85,32.9 98.6,32.9 94.1,28.4 v94.1,28.3
L6A
  Bottom 0.18: IC10.38 77.81,20.72 80.3,23.21 90.8,23.21 95.6,28.01 U$7.7
L7  (via drill 0.35)
  Top 0.305: X6.2 74.76,40.96 76.3,42.5 97.21,42.5 98.41,41.31 104.25,41.31 | 108.11,40.85 | D13.C 121.04,40.85 108.9,40.85 | 108.11,40.85 108.9,40.85 | 108.11,40.85 108.11,40.88 107.67,41.31 104.25,41.31 | v112.1,28.4 112,28.5 112,29.6 108.9,32.7 108.9,40.85 | 104.25,41.31 104.25,39.38 X2.2
  Bottom 0.254: v112.09,28.41 v112.1,28.4 112.1,26.73 U$7.13
L7A
  Bottom 0.15: U$7.6 95.11,26.73 91,22.62
  Bottom 0.18: 91,22.62 80.6,22.62 77.9,19.92 IC10.39
N$1
  Bottom 0.18: IC10.22 60.81,26.41 C8.1
N$2  (via drill 0.3)
  Top 0.18: B8.P$1 18.2,8.91 v18.2,7.95
  Bottom 0.18: R1.2 65.14,6.8 56.5,6.8 52.3,2.6 23.55,2.6 v18.2,7.95
N$3
  Bottom 0.18: IC10.11 62.36,13.97 R30.1
N$4  (via drill 0.3)
  Top 0.18: B1.P$1 15.73,31.41 v18.8,28.35
  Bottom 0.18: R2.2 55.95,24.25 46.05,24.25 43.2,27.1 20.05,27.1 v18.8,28.35
N$5
  Bottom 0.18: R31.1 58.95,14.76 58.95,15.39 59.47,15.92 IC10.12
N$6  (via drill 0.35)
  Top 0.305: D10.A 95.33,9.77 v95.4,9.7
  Bottom 0.305: R19.1 96.2,10.5 v95.4,9.7
N$7  (via drill 0.3)
  Top 0.18: B2.P$1 51.23,11.66 v54.15,8.75
  Bottom 0.18: R3.2 64.01,7.79 55.11,7.79 v54.15,8.75
N$8  (via drill 0.3)
  Top 0.18: B3.P$1 52.92,31.41 v54.78,29.55
  Bottom 0.18: R4.2 v54.78,29.55
N$9  (via drill 0.3)
  Top 0.18: B4.P$1 118.8,33.16 v118.8,35.55
  Bottom 0.18: R5.2 64.14,34.35 65.8,36 78.75,36 80.95,38.2 80.95,42.55 arc-90 82.23,43.83 110.52,43.83 v118.8,35.55
N$10  (via drill 0.3)
  Top 0.18: B5.P$1 85.51,11.65 v80.95,11.65
  Bottom 0.18: v80.95,11.65 77.22,11.65 R6.2
N$11  (via drill 0.3)
  Top 0.18: B6.P$1 84.19,31.41 v81.7,33.9
  Bottom 0.18: R7.2 66.36,34.2 67.37,35.22 80.4,35.22 81.7,33.92 v81.7,33.9
N$12  (via drill 0.3)
  Top 0.305: D13.A 118.54,39.15 117.2,39.15 110.7,32.65 v110.7,32.2
  Bottom 0.305: R18.1 112.04,33.53 v110.7,32.2
N$13
  Bottom 0.254: R12.2 106.15,17.7 C11.1 110.6,15.95 V+.1
N$14  (via drill 0.3)
  Top 0.305: D12.A 93.58,33.3 v95.4,33.3
  Bottom 0.305: R20.1 94.82,33.3 v95.4,33.3
N$15  (via drill 0.3)
  Top 0.254: 42.22,33.2 D6.A
  Top 0.305: v40.5,33.2 42.22,33.2
  Bottom 0.305: R16.1 40.84,33.2 v40.5,33.2
N$16  (via drill 0.3)
  Top 0.18: B7.P$1 118.19,9.3 v116.85,9.3
  Bottom 0.18: R8.2 76.42,10.28 84.1,2.6 114.05,2.6 115.55,4.1 115.55,8 v116.85,9.3
N$17  (via drill 0.3)
  Top 0.305: v42,8.8 42.4,9.2 D7.A
  Bottom 0.254: 39.39,10.28 R11.1
  Bottom 0.305: v42,8.8 40.87,8.8 39.39,10.28
N$19  (via drill 0.3)
  Top 0.305: v122.6,20 123.1,20 128.75,14.35 128.75,13.1 D15.A
  Bottom 0.305: R29.1 123.71,20 v122.6,20
N$23  (via drill 0.3)
  Top 0.254: D3.A 18.52,23.33 20.6,25.41 25.1,31.42 v25.1,32.9
  Bottom 0.254: R10.1 24.05,33.95
  Bottom 0.305: 24.05,33.95 v25.1,32.9
  Bottom 0.406: R10.1 arc-90 R10.1
N$24  (via drill 0.3)
  Top 0.254: 24.77,9.9 17.83,3.57 D1.A
  Top 0.305: v25.5,9.9 24.77,9.9
  Bottom 0.305: v25.5,9.9 25.4,9.9 24.44,8.94 R9.1
N$25  (via drill 0.3)
  Top 0.254: D5.A 52,39.53
  Top 0.305: 52,39.53 v52,41.1
  Bottom 0.305: v52,41.1 52.98,40.12 R24.1
N$26  (via drill 0.3)
  Top 0.254: D11.A 83.37,39.9
  Top 0.305: 83.37,39.9 v82.5,39.9
  Bottom 0.254: v82.51,39.91 v82.5,39.9
  Bottom 0.305: R27.1 88.26,38 83.55,38 82.51,39.05 v82.51,39.91
N$27  (via drill 0.3)
  Top 0.305: D9.A 85.25,2.2 89,2.2 90.8,4 v92.5,4
  Bottom 0.305: R26.1 94.14,4.69 93.45,4 v92.5,4
N$28  (via drill 0.3)
  Top 0.305: v122.5,23.12 123.1,23.12 128.6,28.62 D14.A
  Bottom 0.305: R25.1 v122.5,23.12
N$29  (via drill 0.3)
  Top 0.254: D2.A 7.4,14.42
  Top 0.305: 7.4,14.42 12.94,19.96 v13.6,19.96
  Bottom 0.254: 12.56,19.96 R21.1
  Bottom 0.305: R21.1 arc-90 12.56,19.96 v13.6,19.96
N$30  (via drill 0.3)
  Top 0.305: v17.5,39.85 11.15,39.85 6.3,35 6.3,29.9 6.85,29.35 D4.A
  Bottom 0.305: R22.1 17.76,39.59 v17.5,39.85
N$31  (via drill 0.35)
  Top 0.305: v43,4 43,2.85 43.6,2.25 50.92,2.25 D8.A
  Bottom 0.305: R23.1 42.03,4.97 v43,4
N$32  (via drill 0.3)
  Top 0.305: D16.A 122.9,3.55 v122.95,3.5
  Bottom 0.305: R28.1 121.79,3.5 v122.95,3.5
N$47
  Bottom 0.254: IC10.33 70.56,26.8 71.2,27.44 C5.1
OUT  (via drill 0.35)
  Top 0.305: v106.15,15.45 106.15,19.55 v107.15,20.55 | v107.1,22.45 107.1,38.5 107.1,39.01 X2.1
  Bottom 0.305: S.1 105.6,14.9 v106.15,15.45 | v107.15,20.55 107.15,22.4 v107.1,22.45
RST
  Bottom 0.18: IC10.32 69.76,27.91 J1.1 68.89,28.77 C6.2
SCL  (via drill 0.3)
  Top 0.254: v61.9,2.4 60.2,2.4 arc-90 59.63,2.97 X5.3 60.08,4.68 61.69,6.29 v61.69,11.16 v61.7,11.18
  Bottom 0.254: X4.3 70.25,2.4 v61.9,2.4 | R30.2 61.62,11.18 v61.7,11.18 62.53,11.18 R.2
SDA  (via drill 0.3)
  Top 0.254: X5.4 57.09,5.59 arc-90 57.5,6 58.9,6 arc90 59.55,6.65 59.55,7.95 arc90 v58.8,8.7
  Bottom 0.254: X5.4 57.09,3.89 arc-90 56.7,3.5 56.14,3.5 arc90 55.73,3.09 arc90 56.24,2.58 57.97,2.58 arc45 58.5,2.8 58.6,2.9 arc-45 59.08,3.1 68.41,3.1 arc90 X4.4 | R31.2 58.55,9.91 RR.1 58.8,9.55 v58.8,8.7
SW1
  Bottom 0.18: IC10.8 64.95,13.14 65.4,12.7 67,12.7 67.57,12.13 R1.1
SW2
  Bottom 0.18: IC10.21 59.38,23.12 R2.1
SW3
  Bottom 0.18: IC10.9 64.16,12.46 R3.1
SW4
  Bottom 0.18: IC10.24 63.36,27.22 R4.1
SW5
  Bottom 0.18: R6.1 73.99,12.78 70.22,12.78 69.76,13.25 IC10.2
SW6
  Bottom 0.18: IC10.29 67.36,27.9 66.36,28.9 R7.1
SW7
  Bottom 0.18: IC10.28 66.56,27.71 64.14,30.12 R5.1
W1  (via drill 0.35)
  Top 0.305: D2.C 7.35,9.8 6.7,9.8 6,10.5 6,14.15 12.55,20.7 18,20.7 v18.5,20.2
  Bottom 0.305: v18.5,20.2 19.5,20.2 21.73,17.98 U$44.12
W1A  (via drill 0.3)
  Top 0.254: J8.2 32.8,13.23 32.8,16.5 34.25,17.95 v36,17.95
  Bottom 0.18: U$44.7 45.28,17.98 46.35,19.05 55.1,19.05 57.43,16.72 IC10.13
  Bottom 0.254: U$44.7 37.62,17.95 v36,17.95
W2  (via drill 0.35)
  Top 0.305: v11.8,38.85 8.65,35.7 7.5,34.35 D4.C
  Bottom 0.305: U$44.15 24.02,21.79 21.95,23.85 13.05,23.85 arc-45 11.26,24.59 8.54,27.31 arc-45 7.8,29.1 7.8,33.8 arc-45 8.54,35.59 v11.8,38.85
W2A
  Bottom 0.18: U$44.4 41.87,21.79 42.48,21.18 56.78,21.18 58.83,19.12 IC10.16
W3  (via drill 0.3)
  Top 0.305: v42.35,7.3 D8.C
  Bottom 0.254: U$44.13 31.06,19.25 34.45,15.85 34.45,13.25 35.6,12.1 35.6,8.1 36.4,7.3 v42.35,7.3
W3A  (via drill 0.3)
  Top 0.254: v35.95,19.25 33.95,19.25 31.8,17.1 31.8,14.63 J8.1
  Bottom 0.18: U$44.6 45.39,19.25 45.9,19.75 55.75,19.75 57.98,17.52 IC10.14
  Bottom 0.254: v35.95,19.25 U$44.6
W4  (via drill 0.35)
  Top 0.305: v32.6,25.6 32.6,32.8 39.7,39.9 v47.4,39.9 48.13,39.9 D5.C
  Bottom 0.305: U$44.18 v32.6,25.6
W4A
  Bottom 0.18: IC10.20 59,22.32 58.2,23.12 45.08,23.12 42.61,25.59 U$44.1
W5  (via drill 0.3)
  Top 0.254: 89.11,4.21 D9.C
  Top 0.305: v93.7,7.4 92.3,7.4 89.11,4.21
  Bottom 0.305: U$7.16 109.15,23.32 106.48,23.32 98.75,15.6 98.75,9.25 98.25,8.75 95.05,8.75 v93.7,7.4
W5A
  Bottom 0.18: IC10.42 78.48,17.52 81.4,20.44 92.26,20.44 95.04,23.23 99.44,23.23 U$7.3
W6  (via drill 0.3)
  Top 0.305: v88.4,40.6 87.35,39.55 D11.C
  Bottom 0.305: v88.4,40.6 95.85,40.6 98.95,37.5 98.95,33.95 102.9,33.95 107.58,29.27 U$7.11
W6A
  Bottom 0.18: IC10.37 77.67,21.52 80.06,23.9 90.67,23.9 96.1,29.32 99.69,29.32 U$7.8
W7  (via drill 0.35)
  Top 0.305: v117.5,22.8 117.95,22.35 123.64,22.35 129.95,29.11 129.95,32 D14.C
  Bottom 0.305: v117.5,22.8 117.45,22.8 117.4,22.85 115.11,22.85 112.5,25.46 U$7.14
W7A
  Bottom 0.18: IC10.40 78.15,19.12 80.85,21.82 91.1,21.82 94.74,25.46 U$7.5

### Text on the board
tPlace: SDA | SCL | G | 5V | SDA | SCL | G | 5V
bPlace: CLK | IO
tNames: D15
bNames: V- | L7 | V+ | R | SMD / Innovation